# EAGLE design qtpy_midibff (EAGLE 9.6.2)
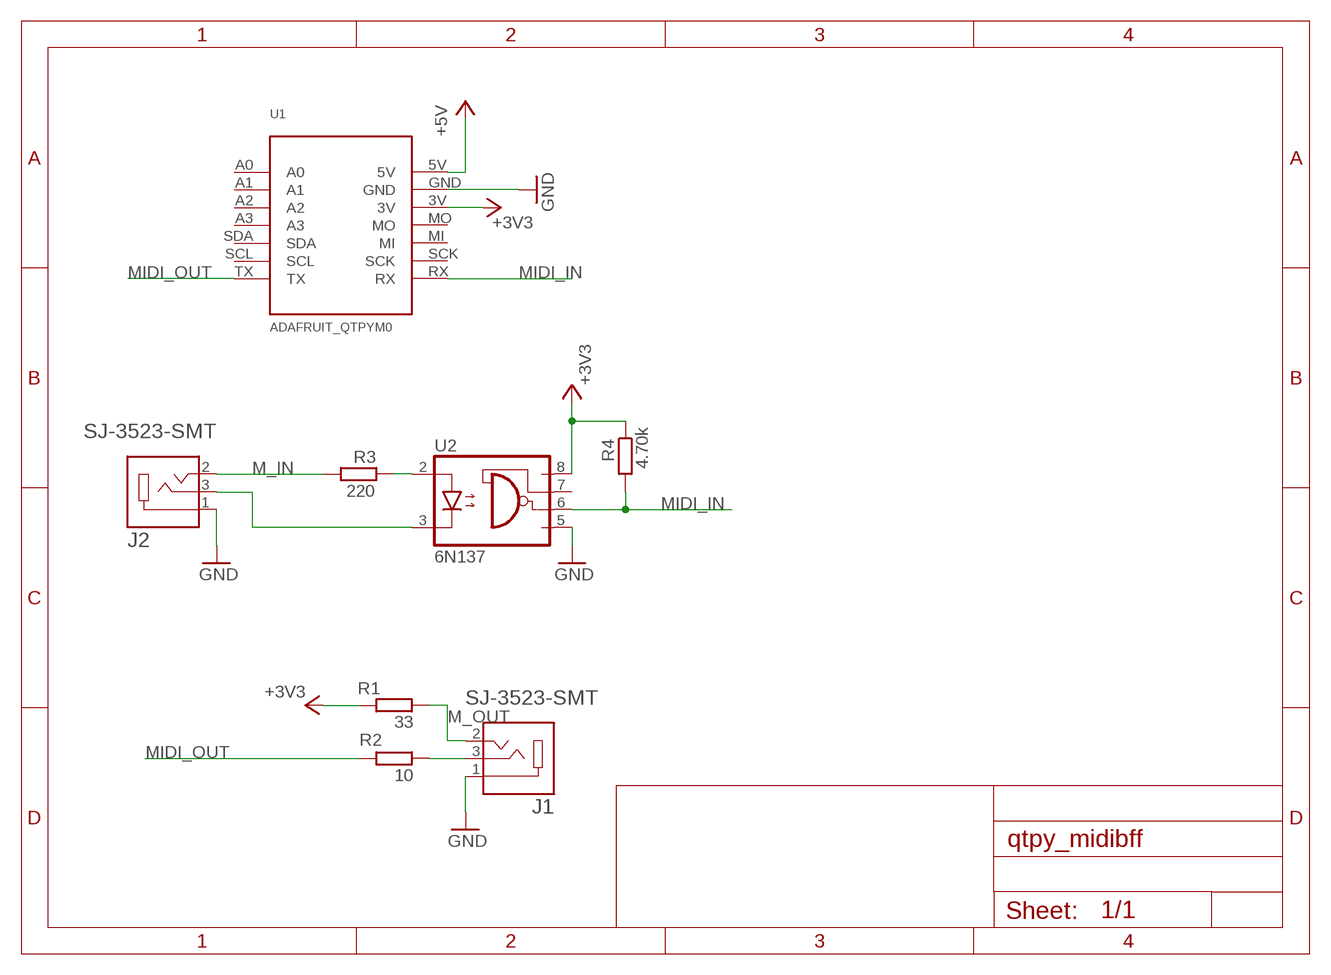
[diagram p0: schematic, sheet 1]

## Parts
J1  SJ-3523-SMT  [CUI_SJ-3523-SMT]
J2  SJ-3523-SMT  [CUI_SJ-3523-SMT]
R1  33  R-EU_0204/7  [0204/7]
R2  10  R-EU_0204/7  [0204/7]
R3  220  R-EU_0204/7  [0204/7]
R4  4.70k  R-EU_0204/7  [0204/7]
U1  ADAFRUIT_QTPYM0  [ADAFRUIT_QTPY_M0]
U2  6N137  [DIL08]

## Nets
+3V3: R1.2 R4.1 U1.3V U2.8(VCC)
GND: J1.1 J2.1 U1.GND U2.5(GND)
M_IN: J2.2 R3.2
M_OUT: J1.2 R1.1
MIDI_IN: R4.2 U1.RX U2.6(VO)
MIDI_OUT: R2.2 U1.TX
N$1: J1.3 R2.1
N$2: R3.1 U2.2(A)
N$4: J2.3 U2.3(C)
VLED: U1.5V ; supply symbol labelled +5V
Unconnected: U1.A0 U1.A1 U1.A2 U1.A3 U1.MI U1.MO U1.SCK U1.SCL U1.SDA U2.7(VE)

## Library data of the parts
J1 J2 = SJ-3523-SMT:SJ-3523-SMT: Audio Jack Connector 3.5 mm Low Profile Surface Mount Stereo Jack, 3 Pin Right-Angle; CUI_PURCHASE_URL: https://www.cuidevices.com/product/interconnect/connectors/audio-connectors/jacks/sj-352x-smt-series?utm_source=snapeda.com&utm_medium=referral&utm_campaign=snapedaBOM; DESCRIPTION: 3.5 mm, Stereo, Right Angle, Surface Mount (SMT), 3 Conductors, 0~1 Internal Switches, Audio Jack Connector; DIGI-KEY_PART_NUMBER: CP-3523SJCT-ND; MF: CUI Devices; MP: SJ-3523-SMT-TR; PACKAGE: None; PURCHASE-URL: https://pricing.snapeda.com/search/part/SJ-3523-SMT-TR/?ref=eda
R1-R4 = rcl:R-EU_: RESISTOR, European symbol; SPICEPREFIX: R
U1 = todstuff:ADAFRUIT_QTPY
U2 = optocoupler:6N137: MOTOROLA OPTO COUPLER; MPN: 6N137; OC_FARNELL: 1328376; OC_NEWARK: 52M1895

## Board
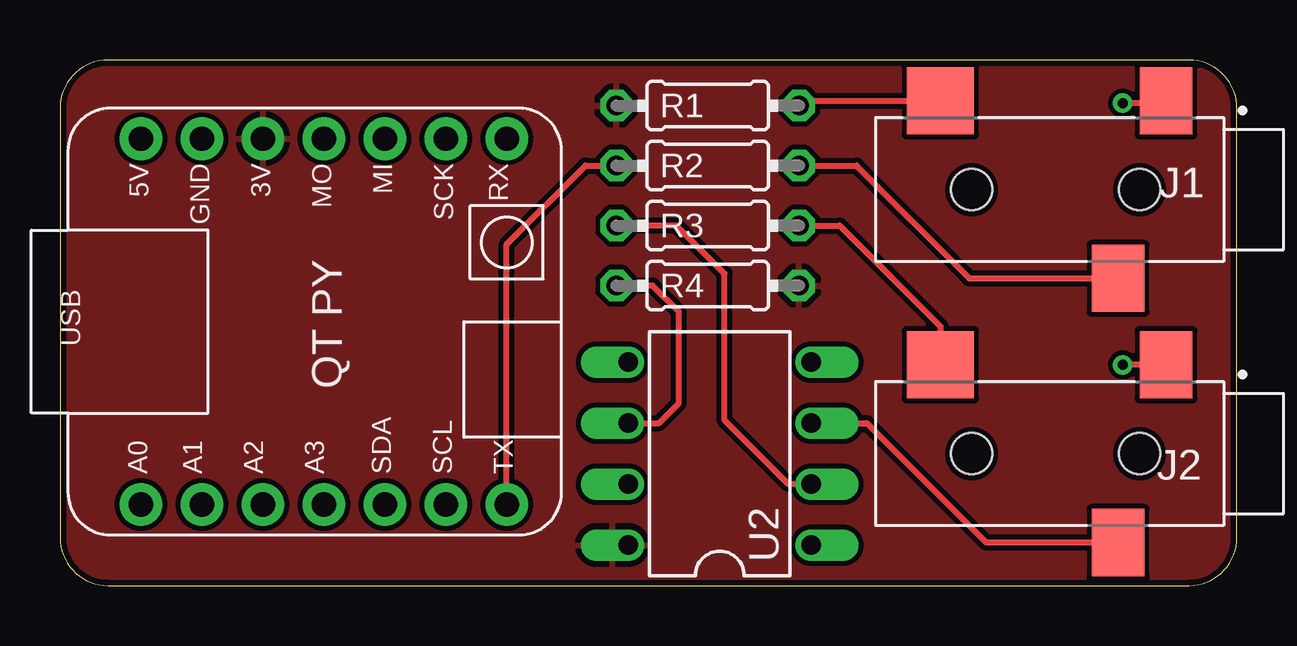
[diagram p1: board, top side]
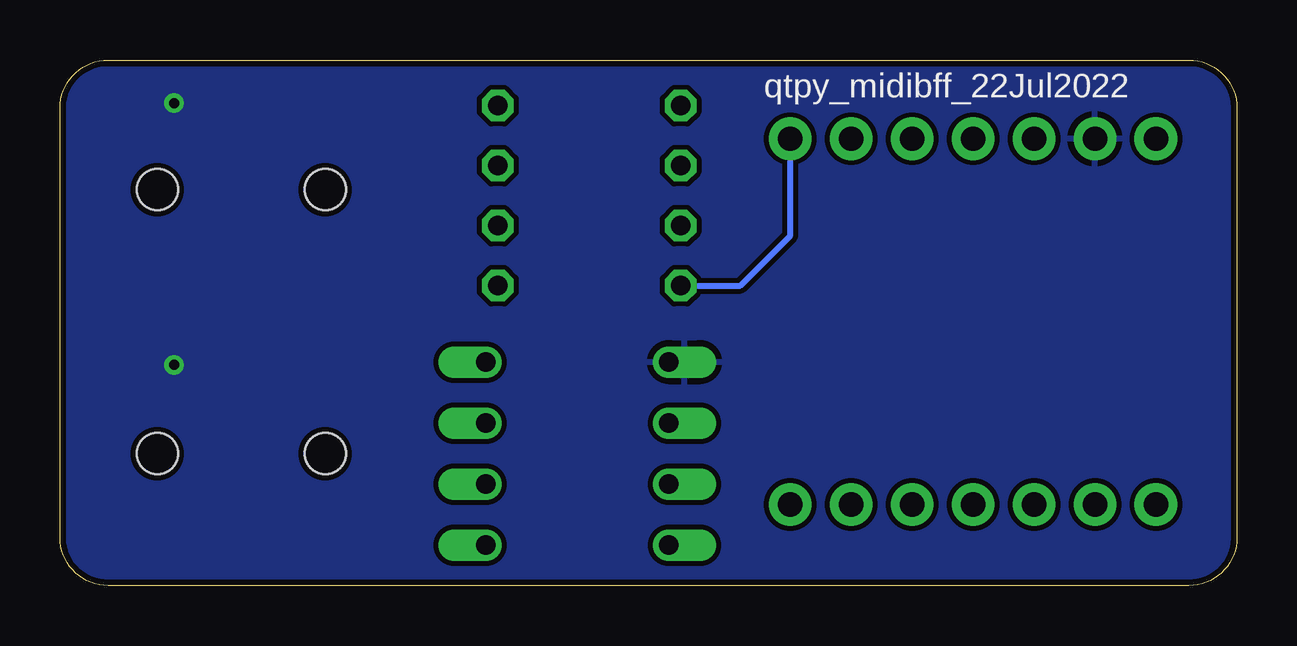
[diagram p2: board, bottom side, seen from below]

Size 49.06 x 21.9 mm. Coordinates in mm from the lower left corner, seen from the top.
Outline: 2,0 47.06,0 arc90 49.06,2 49.06,19.9 arc90 47.06,21.9 2,21.9 arc90 0,19.9 0,2 arc90 2,0
Copper layers (1*16): Top 0.035mm / dielectric 1.5mm / Bottom 0.035mm
Design rules "adafruit-rules-20180530": minimum track width 8mil, minimum drill 16mil, track to track 8mil, track to pad 8mil, pad to pad 8mil, via to via 8mil, smd to smd 8mil, copper to edge 10mil, drill to drill 8mil, minimum pad ring 10mil, minimum via ring 8mil, stop-mask expansion 4mil, vias tented up to drill 20mil, thermal gap 10mil

### Footprints (pad centres in the part's own frame; a part is rotated, then mirrored left to right if it is on the bottom)
CUI_SJ-3523-SMT = smd 2.2 x 2.8: 1 -1.1,-3.7; 3 0.9,3.7 | smd 2.8 x 2.8: 2 8.3,-3.7 | hole 1.7: 0,0; 7,0
0204/7 = drill 0.813 octagon: 1 -3.81,0; 2 3.81,0
ADAFRUIT_QTPY_M0 = drill 1.016 pad 1.778: 3V 7.62,2.54; 5V 7.62,7.62; A0 -7.62,7.62; A1 -7.62,5.08; A2 -7.62,2.54; A3 -7.62,0; GND 7.62,5.08; MI 7.62,-2.54; MO 7.62,0; RX 7.62,-7.62; SCK 7.62,-5.08; SCL -7.62,-5.08; SDA -7.62,-2.54; TX -7.62,-7.62
DIL08 = drill 0.813 offset: 1 -3.81,-3.81; 2 -1.27,-3.81; 3 1.27,-3.81; 4 3.81,-3.81; 5 3.81,3.81; 6 1.27,3.81; 7 -1.27,3.81; 8 -3.81,3.81

### Placement (x,y rotation side)
J1  45,16.5 180 top
J2  45,5.5 180 top
R1  27,20 180 top
R2  27,17.5 180 top
R3  27,15 0 top
R4  27,12.5 180 top
U1  11,11 90 top
U2  27.5,5.5 90 top

### Tracks (layer width: path | path; a pad name or v marks a point on that pad's centre or on a via)
+3V3
  pour Top: 51.1,23.17 51.1,-1.02 -1.4,-1.02 -1.4,23.17
GND  (via drill 0.41)
  Top 0.254: J1.1 46,20.1 v44.3,20.1 | J2.1 v44.3,9.2
  pour Bottom: -1.27,22.67 51.13,22.67 51.13,-1.02 -1.27,-1.02
M_IN
  Top 0.254: R3.2 32.5,15 36.7,10.8 J2.2
M_OUT
  Top 0.254: R1.1 31.01,20.2 J1.2
MIDI_IN
  Top 0.254: U2.6 24.97,6.77 25.8,7.6 25.8,11.4 24.7,12.5 R4.2
  Bottom 0.254: R4.2 20.7,12.5 18.62,14.58 U1.RX
MIDI_OUT
  Top 0.254: U1.TX 18.62,14.22 21.9,17.5 R2.2
N$1
  Top 0.254: R2.1 33.2,17.5 37.9,12.8 J1.3
N$2
  Top 0.254: U2.2 30.37,4.23 27.7,6.9 27.7,13 25.7,15 R3.1
N$4
  Top 0.254: U2.3 33.63,6.77 38.6,1.8 J2.3

### Text on the board
tPlace: OUT | MIDI FRIEND | TRS-A | MIDI | IN
bPlace: qtpy_midibff_22Jul2022 | TRS-A | MIDI OUT | TRS-A | MIDI IN